# Altium schematic sheet Schematic.SchDoc
size A4; DrawnBy: HuangYanjun
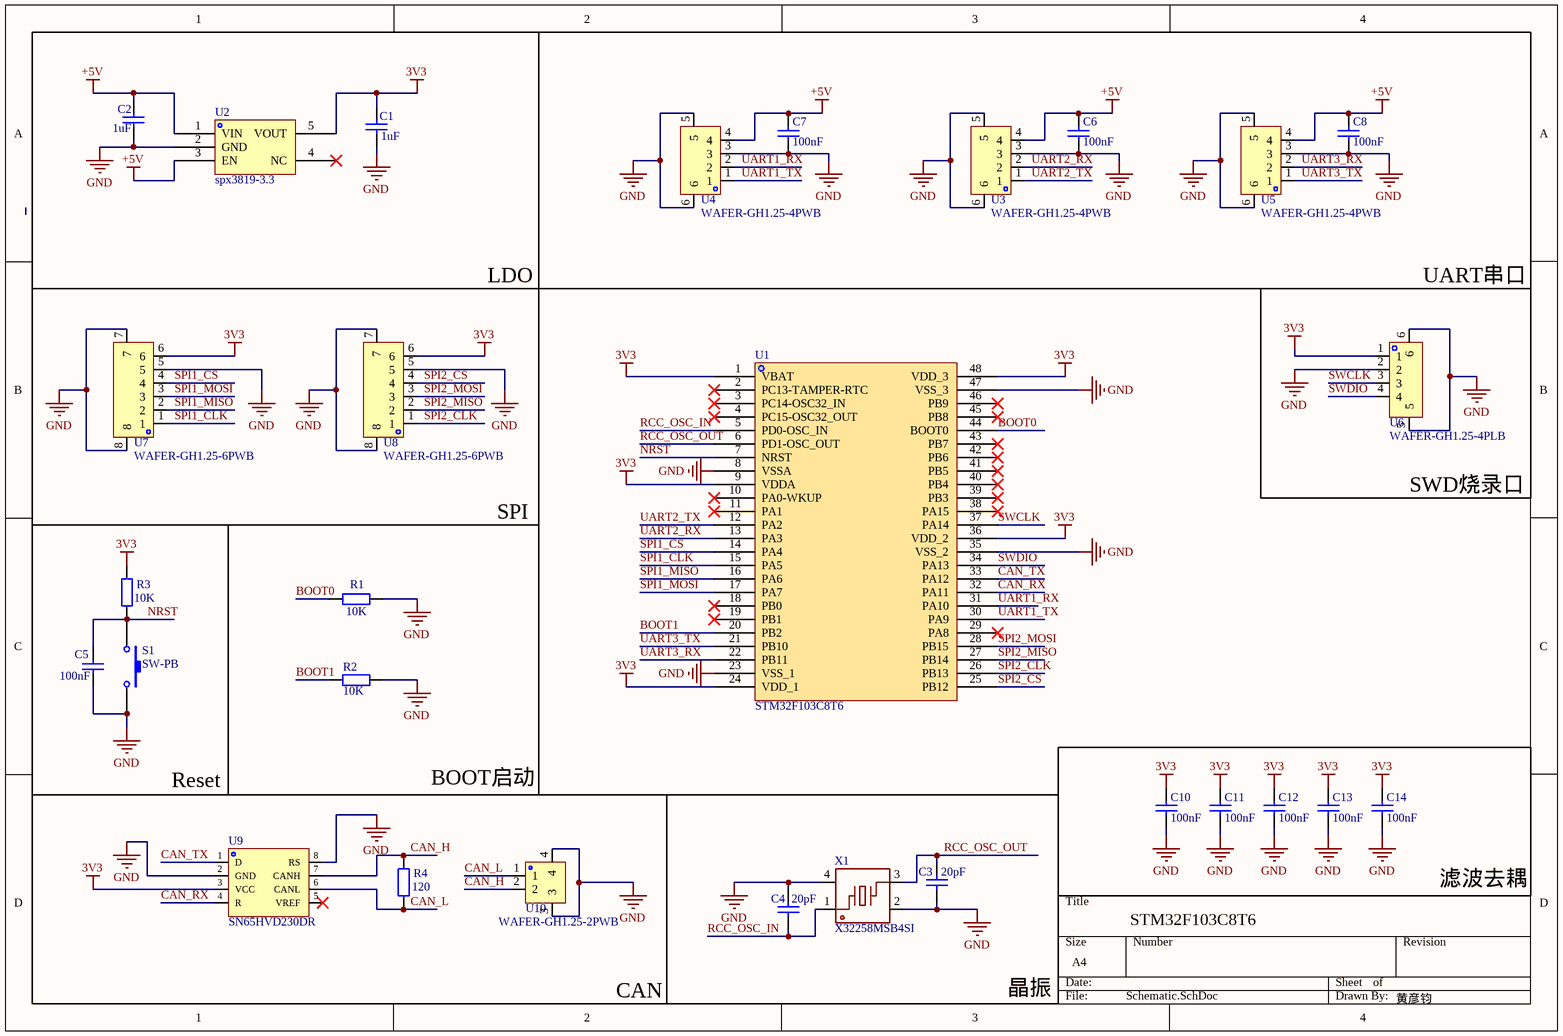
[diagram p0: Schematic.SchDoc]

## Parts
C1  value 1uF  [CAP_0603]
C2  value 1uF  [CAP_0603]
C3  value 20pF  [CAP_0603]
C4  value 20pF  [CAP_0603]
C5  value 100nF  [CAP_0603]
C6  value 100nF  [CAP_0603]
C7  value 100nF  [CAP_0603]
C8  value 100nF  [CAP_0603]
C10  value 100nF  [CAP_0603]
C11  value 100nF  [CAP_0603]
C12  value 100nF  [CAP_0603]
C13  value 100nF  [CAP_0603]
C14  value 100nF  [CAP_0603]
R1  value 10K  [RES_0603]
R2  value 10K  [RES_0603]
R3  value 10K  [RES_0603]
R4  value 120  [RES_0603]
S1  SW-PB  [SW]
U1  STM32F103C8T6  [STM32F103C8T6]
U2  spx3819-3.3  [spx3819-3.3]
U3  WAFER-GH1.25-4PWB  [WAFER-GH1.25-4PWB]
U4  WAFER-GH1.25-4PWB  [WAFER-GH1.25-4PWB]
U5  WAFER-GH1.25-4PWB  [WAFER-GH1.25-4PWB]
U6  WAFER-GH1.25-4PLB  [WAFER-GH1.25-4PLB]
U7  WAFER-GH1.25-6PWB  [WAFER-GH1.25-6PWB]
U8  WAFER-GH1.25-6PWB  [WAFER-GH1.25-6PWB]
U9  SN65HVD230DR  [SN65HVD230DR]
U10  WAFER-GH1.25-2PWB  [WAFER-GH1.25-2PWB]
X1  X32258MSB4SI  [X32258MSB4SI]

## Nets
3V3: C1.2 C10.2 C11.2 C12.2 C13.2 C14.2 R3.2 U1.1(VBAT) U1.9(VDDA) U1.24(VDD_1) U1.36(VDD_2) U1.48(VDD_3) U2.5(VOUT) U6.1 U7.6 U8.6 U9.3(VCC)
+5V: C2.2 C6.2 C7.2 C8.2 U2.1(VIN) U2.3(EN) U3.4 U4.4 U5.4
GND: C1.1 C2.1 C3.1 C4.2 C5.2 C6.1 C7.1 C8.1 C10.1 C11.1 C12.1 C13.1 C14.1 R1.1 R2.2 S1.2 U1.8(VSSA) U1.23(VSS_1) U1.35(VSS_2) U1.47(VSS_3) U2.2(GND) U3.3 U3.5 U3.6 U4.3 U4.5 U4.6 U5.3 U5.5 U5.6 U6.2 U6.5 U6.6 U7.5 U7.7 U7.8 U8.5 U8.7 U8.8 U9.2(GND) U9.8(RS) U10.3 U10.4 X1.2 X1.4
BOOT0: R1.2 U1.44(BOOT0)
BOOT1: R2.1 U1.20(PB2)
CAN_H: R4.1 U9.7(CANH) U10.2
CAN_L: R4.2 U9.6(CANL) U10.1
CAN_RX: U1.32(PA11) U9.4(R)
CAN_TX: U1.33(PA12) U9.1(D)
NRST: C5.1 R3.1 S1.1 U1.7(NRST)
RCC_OSC_IN: C4.1 U1.5(PD0-OSC_IN) X1.1
RCC_OSC_OUT: C3.2 U1.6(PD1-OSC_OUT) X1.3
SPI1_CLK: U1.15(PA5) U7.1
SPI1_CS: U1.14(PA4) U7.4
SPI1_MISO: U1.16(PA6) U7.2
SPI1_MOSI: U1.17(PA7) U7.3
SPI2_CLK: U1.26(PB13) U8.1
SPI2_CS: U1.25(PB12) U8.4
SPI2_MISO: U1.27(PB14) U8.2
SPI2_MOSI: U1.28(PB15) U8.3
SWCLK: U1.37(PA14) U6.3
SWDIO: U1.34(PA13) U6.4
UART1_RX: U1.31(PA10) U4.2
UART1_TX: U1.30(PA9) U4.1
UART2_RX: U1.13(PA3) U3.2
UART2_TX: U1.12(PA2) U3.1
UART3_RX: U1.22(PB11) U5.2
UART3_TX: U1.21(PB10) U5.1

Not connected (* = marked no-connect by the designer): U1 2(PC13-TAMPER-RTC)* 3(PC14-OSC32_IN)* 4(PC15-OSC32_OUT)* 10(PA0-WKUP)* 11(PA1)* 18(PB0)* 19(PB1)* 29(PA8)* 38(PA15)* 39(PB3)* 40(PB4)* 41(PB5)* 42(PB6)* 43(PB7)* 45(PB8)* 46(PB9)*; U2 4(NC)*; U9 5(VREF)*

## Notes on the sheet
- LDO
- UART串口
- SPI
- SWD烧录口
- Reset
- BOOT启动
- STM32F103C8T6
- 滤波去耦
- CAN
- 晶振
- 黄彦钧

## Library data of the parts
C1-C8 C10-C14 = Cap: Capacitor; Published: 8-Jun-2000; LatestRevisionDate: 17-Jul-2002; LatestRevisionNote: Re-released for DXP Platform.; PackageReference: RAD-0.3; Publisher: Altium Limited; PackageDescription: Radial Cap, Thru-Hole; 2 Leads; 0.3 in Pin Spacing
R1-R4 = Res2: Resistor; Published: 8-Jun-2000; LatestRevisionDate: 17-Jul-2002; LatestRevisionNote: Re-released for DXP Platform.; PackageReference: AXIAL-0.4; Publisher: Altium Limited; PackageDescription: Axial Device, Thru-Hole; 2 Leads; 0.4 in Pin Spacing
S1 = SW-PB: Switch; Published: 24-Mar-1999; LatestRevisionDate: 17-Jul-2002; LatestRevisionNote: Re-released for DXP Platform.; PackageReference: SPST-2; Publisher: Altium Limited; PackageDescription: Switch; 2 Leads